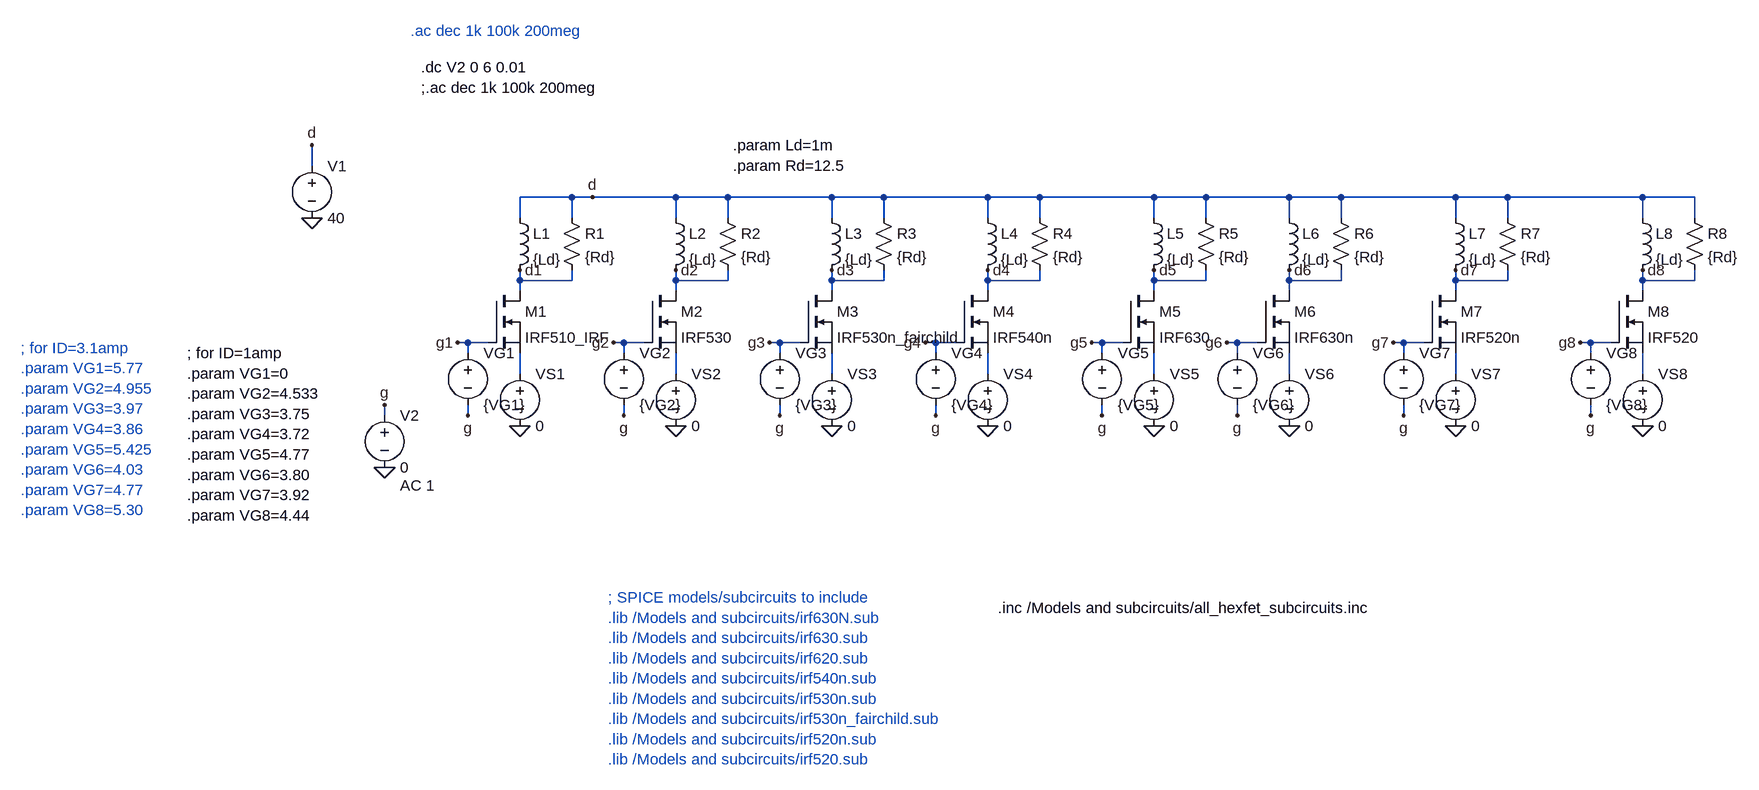
[diagram p0: schematic compare_FET_gm.asc]
compare_FET_gm.asc, the LTspice schematic file:
Version 4
SHEET 1 2116 872
WIRE -96 -32 -96 -64
WIRE 304 16 224 16
WIRE 336 16 304 16
WIRE 464 16 336 16
WIRE 544 16 464 16
WIRE 704 16 544 16
WIRE 784 16 704 16
WIRE 944 16 784 16
WIRE 1024 16 944 16
WIRE 1200 16 1024 16
WIRE 1280 16 1200 16
WIRE 1408 16 1280 16
WIRE 1488 16 1408 16
WIRE 1664 16 1488 16
WIRE 1744 16 1664 16
WIRE 1952 16 1744 16
WIRE 2032 16 1952 16
WIRE 224 48 224 16
WIRE 304 48 304 16
WIRE 464 48 464 16
WIRE 544 48 544 16
WIRE 704 48 704 16
WIRE 784 48 784 16
WIRE 944 48 944 16
WIRE 1024 48 1024 16
WIRE 1200 48 1200 16
WIRE 1280 48 1280 16
WIRE 1408 48 1408 16
WIRE 1488 48 1488 16
WIRE 1664 48 1664 16
WIRE 1744 48 1744 16
WIRE 1952 48 1952 16
WIRE 2032 48 2032 16
WIRE 224 144 224 128
WIRE 304 144 304 128
WIRE 304 144 224 144
WIRE 464 144 464 128
WIRE 544 144 544 128
WIRE 544 144 464 144
WIRE 704 144 704 128
WIRE 784 144 784 128
WIRE 784 144 704 144
WIRE 944 144 944 128
WIRE 1024 144 1024 128
WIRE 1024 144 944 144
WIRE 1200 144 1200 128
WIRE 1280 144 1280 128
WIRE 1280 144 1200 144
WIRE 1408 144 1408 128
WIRE 1488 144 1488 128
WIRE 1488 144 1408 144
WIRE 1664 144 1664 128
WIRE 1744 144 1744 128
WIRE 1744 144 1664 144
WIRE 1952 144 1952 128
WIRE 2032 144 2032 128
WIRE 2032 144 1952 144
WIRE 224 160 224 144
WIRE 464 160 464 144
WIRE 704 160 704 144
WIRE 944 160 944 144
WIRE 1200 160 1200 144
WIRE 1408 160 1408 144
WIRE 1664 160 1664 144
WIRE 1952 160 1952 144
WIRE 144 240 128 240
WIRE 176 240 144 240
WIRE 384 240 368 240
WIRE 416 240 384 240
WIRE 624 240 608 240
WIRE 656 240 624 240
WIRE 864 240 848 240
WIRE 896 240 864 240
WIRE 1120 240 1104 240
WIRE 1152 240 1120 240
WIRE 1328 240 1312 240
WIRE 1360 240 1328 240
WIRE 1584 240 1568 240
WIRE 1616 240 1584 240
WIRE 1872 240 1856 240
WIRE 1904 240 1872 240
WIRE 144 256 144 240
WIRE 384 256 384 240
WIRE 624 256 624 240
WIRE 864 256 864 240
WIRE 1120 256 1120 240
WIRE 1328 256 1328 240
WIRE 1584 256 1584 240
WIRE 1872 256 1872 240
WIRE 224 288 224 256
WIRE 464 288 464 256
WIRE 704 288 704 256
WIRE 944 288 944 256
WIRE 1200 288 1200 256
WIRE 1408 288 1408 256
WIRE 1664 288 1664 256
WIRE 1952 288 1952 256
WIRE 16 352 16 336
WIRE 144 352 144 336
WIRE 384 352 384 336
WIRE 624 352 624 336
WIRE 864 352 864 336
WIRE 1120 352 1120 336
WIRE 1328 352 1328 336
WIRE 1584 352 1584 336
WIRE 1872 352 1872 336
FLAG 128 240 g1
FLAG 224 128 d1
FLAG 16 432 0
FLAG -96 48 0
FLAG -96 -64 d
FLAG 144 352 g
FLAG 16 336 g
FLAG 368 240 g2
FLAG 464 128 d2
FLAG 384 352 g
FLAG 608 240 g3
FLAG 704 128 d3
FLAG 624 352 g
FLAG 848 240 g4
FLAG 944 128 d4
FLAG 864 352 g
FLAG 464 368 0
FLAG 224 368 0
FLAG 704 368 0
FLAG 944 368 0
FLAG 336 16 d
FLAG 1104 240 g5
FLAG 1200 128 d5
FLAG 1120 352 g
FLAG 1200 368 0
FLAG 1312 240 g6
FLAG 1408 128 d6
FLAG 1328 352 g
FLAG 1408 368 0
FLAG 1568 240 g7
FLAG 1664 128 d7
FLAG 1584 352 g
FLAG 1664 368 0
FLAG 1856 240 g8
FLAG 1952 128 d8
FLAG 1872 352 g
FLAG 1952 368 0
SYMBOL voltage -96 -48 R0
WINDOW 123 0 0 Left 0
WINDOW 39 0 0 Left 0
SYMATTR InstName V1
SYMATTR Value 40
SYMBOL voltage 16 336 R0
WINDOW 123 24 124 Left 2
WINDOW 39 0 0 Left 0
SYMATTR Value2 AC 1
SYMATTR InstName V2
SYMATTR Value 0
SYMBOL voltage 144 240 R0
SYMATTR InstName VG1
SYMATTR Value {VG1}
SYMBOL nmos 416 160 R0
SYMATTR InstName M2
SYMATTR Value IRF530
SYMBOL voltage 384 240 R0
SYMATTR InstName VG2
SYMATTR Value {VG2}
SYMBOL voltage 624 240 R0
SYMATTR InstName VG3
SYMATTR Value {VG3}
SYMBOL voltage 864 240 R0
WINDOW 123 0 0 Left 0
WINDOW 39 0 0 Left 0
SYMATTR InstName VG4
SYMATTR Value {VG4}
SYMBOL nmos 896 160 R0
SYMATTR InstName M4
SYMATTR Value IRF540n
SYMATTR Prefix X
SYMBOL voltage 464 272 R0
SYMATTR InstName VS2
SYMATTR Value 0
SYMBOL voltage 224 272 R0
SYMATTR InstName VS1
SYMATTR Value 0
SYMBOL voltage 704 272 R0
SYMATTR InstName VS3
SYMATTR Value 0
SYMBOL voltage 944 272 R0
SYMATTR InstName VS4
SYMATTR Value 0
SYMBOL ind 208 32 R0
SYMATTR InstName L1
SYMATTR Value {Ld}
SYMBOL res 288 32 R0
SYMATTR InstName R1
SYMATTR Value {Rd}
SYMBOL ind 448 32 R0
SYMATTR InstName L2
SYMATTR Value {Ld}
SYMBOL res 528 32 R0
SYMATTR InstName R2
SYMATTR Value {Rd}
SYMBOL ind 688 32 R0
SYMATTR InstName L3
SYMATTR Value {Ld}
SYMBOL res 768 32 R0
SYMATTR InstName R3
SYMATTR Value {Rd}
SYMBOL ind 928 32 R0
SYMATTR InstName L4
SYMATTR Value {Ld}
SYMBOL res 1008 32 R0
SYMATTR InstName R4
SYMATTR Value {Rd}
SYMBOL voltage 1120 240 R0
WINDOW 123 0 0 Left 0
WINDOW 39 0 0 Left 0
SYMATTR InstName VG5
SYMATTR Value {VG5}
SYMBOL nmos 1152 160 R0
SYMATTR InstName M5
SYMATTR Value IRF630
SYMATTR Prefix X
SYMBOL voltage 1200 272 R0
SYMATTR InstName VS5
SYMATTR Value 0
SYMBOL ind 1184 32 R0
SYMATTR InstName L5
SYMATTR Value {Ld}
SYMBOL res 1264 32 R0
SYMATTR InstName R5
SYMATTR Value {Rd}
SYMBOL voltage 1328 240 R0
WINDOW 123 0 0 Left 0
WINDOW 39 0 0 Left 0
SYMATTR InstName VG6
SYMATTR Value {VG6}
SYMBOL nmos 1360 160 R0
SYMATTR InstName M6
SYMATTR Value IRF630n
SYMATTR Prefix X
SYMBOL voltage 1408 272 R0
SYMATTR InstName VS6
SYMATTR Value 0
SYMBOL ind 1392 32 R0
SYMATTR InstName L6
SYMATTR Value {Ld}
SYMBOL res 1472 32 R0
SYMATTR InstName R6
SYMATTR Value {Rd}
SYMBOL voltage 1584 240 R0
WINDOW 123 0 0 Left 0
WINDOW 39 0 0 Left 0
SYMATTR InstName VG7
SYMATTR Value {VG7}
SYMBOL voltage 1664 272 R0
SYMATTR InstName VS7
SYMATTR Value 0
SYMBOL ind 1648 32 R0
SYMATTR InstName L7
SYMATTR Value {Ld}
SYMBOL res 1728 32 R0
SYMATTR InstName R7
SYMATTR Value {Rd}
SYMBOL nmos 656 160 R0
SYMATTR InstName M3
SYMATTR Value IRF530n_fairchild
SYMATTR Prefix X
SYMBOL nmos 1616 160 R0
SYMATTR InstName M7
SYMATTR Value IRF520n
SYMATTR Prefix X
SYMBOL voltage 1872 240 R0
WINDOW 123 0 0 Left 0
WINDOW 39 0 0 Left 0
SYMATTR InstName VG8
SYMATTR Value {VG8}
SYMBOL voltage 1952 272 R0
SYMATTR InstName VS8
SYMATTR Value 0
SYMBOL ind 1936 32 R0
SYMATTR InstName L8
SYMATTR Value {Ld}
SYMBOL res 2016 32 R0
SYMATTR InstName R8
SYMATTR Value {Rd}
SYMBOL nmos 1904 160 R0
SYMATTR InstName M8
SYMATTR Value IRF520
SYMATTR Prefix X
SYMBOL nmos 176 160 R0
SYMATTR InstName M1
SYMATTR Value IRF510_IRF
SYMATTR Prefix X
TEXT -288 256 Left 2 !; for ID=1amp\n.param VG1=0\n.param VG2=4.533\n.param VG3=3.75\n.param VG4=3.72\n.param VG5=4.77\n.param VG6=3.80\n.param VG7=3.92\n.param VG8=4.44
TEXT 360 632 Left 2 ;; SPICE models/subcircuits to include\n.lib /Models and subcircuits/irf630N.sub\n.lib /Models and subcircuits/irf630.sub\n.lib /Models and subcircuits/irf620.sub\n.lib /Models and subcircuits/irf540n.sub\n.lib /Models and subcircuits/irf530n.sub\n.lib /Models and subcircuits/irf530n_fairchild.sub\n.lib /Models and subcircuits/irf520n.sub\n.lib /Models and subcircuits/irf520.sub
TEXT 56 -240 Left 2 ;.ac dec 1k 100k 200meg
TEXT 72 -184 Left 2 !.dc V2 0 6 0.01\n;.ac dec 1k 100k 200meg
TEXT 552 -64 Left 2 !.param Ld=1m\n.param Rd=12.5
TEXT -544 248 Left 2 ;; for ID=3.1amp\n.param VG1=5.77\n.param VG2=4.955\n.param VG3=3.97\n.param VG4=3.86\n.param VG5=5.425\n.param VG6=4.03\n.param VG7=4.77\n.param VG8=5.30
TEXT 960 648 Left 2 !.inc /Models and subcircuits/all_hexfet_subcircuits.inc

The netlist it stands for:
* compare_FET_gm.asc
V1 d 0 40
V2 g 0 0 AC 1
VG1 g1 g {VG1}
M2 d2 g2 N002 N002 IRF530
VG2 g2 g {VG2}
VG3 g3 g {VG3}
VG4 g4 g {VG4}
XM4 d4 g4 N004 IRF540n  ; pins D G S
VS2 N002 0 0
VS1 N001 0 0
VS3 N003 0 0
VS4 N004 0 0
L1 d d1 {Ld}
R1 d d1 {Rd}
L2 d d2 {Ld}
R2 d d2 {Rd}
L3 d d3 {Ld}
R3 d d3 {Rd}
L4 d d4 {Ld}
R4 d d4 {Rd}
VG5 g5 g {VG5}
XM5 d5 g5 N005 IRF630  ; pins D G S
VS5 N005 0 0
L5 d d5 {Ld}
R5 d d5 {Rd}
VG6 g6 g {VG6}
XM6 d6 g6 N006 IRF630n  ; pins D G S
VS6 N006 0 0
L6 d d6 {Ld}
R6 d d6 {Rd}
VG7 g7 g {VG7}
VS7 N007 0 0
L7 d d7 {Ld}
R7 d d7 {Rd}
XM3 d3 g3 N003 IRF530n_fairchild  ; pins D G S
XM7 d7 g7 N007 IRF520n  ; pins D G S
VG8 g8 g {VG8}
VS8 N008 0 0
L8 d d8 {Ld}
R8 d d8 {Rd}
XM8 d8 g8 N008 IRF520  ; pins D G S
XM1 d1 g1 N001 IRF510_IRF  ; pins D G S
.model NMOS NMOS
.model PMOS PMOS
.lib standard.mos
; for ID=1amp
.param VG1=0
.param VG2=4.533
.param VG3=3.75
.param VG4=3.72
.param VG5=4.77
.param VG6=3.80
.param VG7=3.92
.param VG8=4.44
* ; SPICE models/subcircuits to include
* .lib /Models and subcircuits/irf630N.sub
* .lib /Models and subcircuits/irf630.sub
* .lib /Models and subcircuits/irf620.sub
* .lib /Models and subcircuits/irf540n.sub
* .lib /Models and subcircuits/irf530n.sub
* .lib /Models and subcircuits/irf530n_fairchild.sub
* .lib /Models and subcircuits/irf520n.sub
* .lib /Models and subcircuits/irf520.sub
* .ac dec 1k 100k 200meg
.dc V2 0 6 0.01
;.ac dec 1k 100k 200meg
.param Ld=1m
.param Rd=12.5
* ; for ID=3.1amp
* .param VG1=5.77
* .param VG2=4.955
* .param VG3=3.97
* .param VG4=3.86
* .param VG5=5.425
* .param VG6=4.03
* .param VG7=4.77
* .param VG8=5.30
.inc /Models and subcircuits/all_hexfet_subcircuits.inc
.backanno
.end